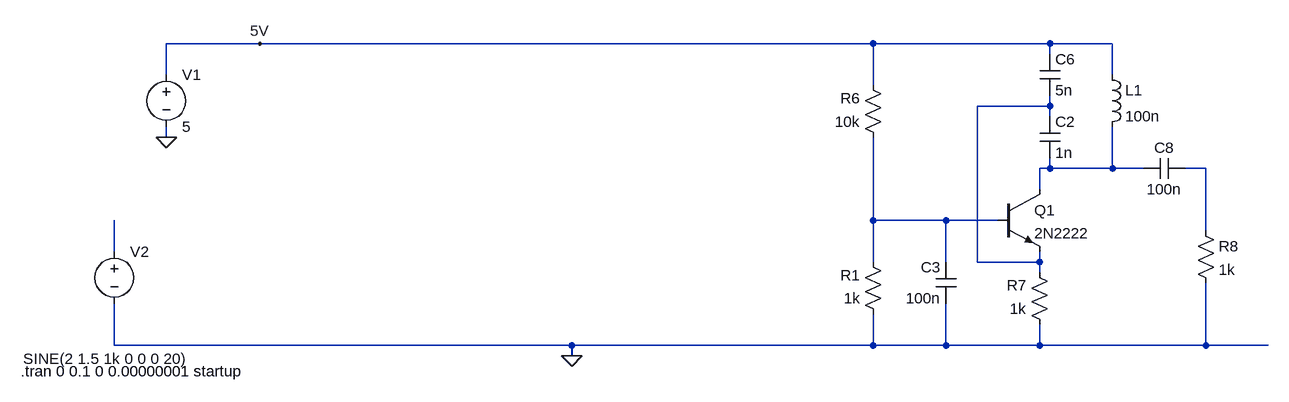
[diagram p0: schematic Colpitts_oscillator.asc]
Colpitts_oscillator.asc, the LTspice schematic file:
Version 4
SHEET 1 1672 680
WIRE -16 -144 -160 -144
WIRE 928 -144 -16 -144
WIRE 1200 -144 928 -144
WIRE 1296 -144 1200 -144
WIRE 1200 -128 1200 -144
WIRE -160 -96 -160 -144
WIRE 1296 -96 1296 -144
WIRE 928 -80 928 -144
WIRE 1200 -48 1200 -64
WIRE 1200 -48 1088 -48
WIRE 1200 -32 1200 -48
WIRE -160 0 -160 -16
WIRE 1200 48 1200 32
WIRE 1200 48 1184 48
WIRE 1296 48 1296 -16
WIRE 1296 48 1200 48
WIRE 1344 48 1296 48
WIRE 1440 48 1408 48
WIRE 1184 80 1184 48
WIRE 928 128 928 0
WIRE 1040 128 928 128
WIRE 1120 128 1040 128
WIRE 1440 144 1440 48
WIRE -240 176 -240 128
WIRE 928 192 928 128
WIRE 1040 192 1040 128
WIRE 1088 192 1088 -48
WIRE 1184 192 1184 176
WIRE 1184 192 1088 192
WIRE 1184 208 1184 192
WIRE -240 320 -240 256
WIRE 464 320 -240 320
WIRE 928 320 928 272
WIRE 928 320 464 320
WIRE 1040 320 1040 256
WIRE 1040 320 928 320
WIRE 1184 320 1184 288
WIRE 1184 320 1040 320
WIRE 1440 320 1440 224
WIRE 1440 320 1184 320
WIRE 1536 320 1440 320
WIRE 464 336 464 320
FLAG 464 336 0
FLAG -16 -144 5V
FLAG -160 0 0
SYMBOL res 944 16 R180
WINDOW 0 36 76 Left 2
WINDOW 3 36 40 Left 2
SYMATTR InstName R6
SYMATTR Value 10k
SYMBOL res 1200 304 R180
WINDOW 0 36 76 Left 2
WINDOW 3 36 40 Left 2
SYMATTR InstName R7
SYMATTR Value 1k
SYMBOL cap 1184 -128 R0
SYMATTR InstName C6
SYMATTR Value 5n
SYMBOL cap 1408 32 R90
WINDOW 0 0 32 VBottom 2
WINDOW 3 32 32 VTop 2
SYMATTR InstName C8
SYMATTR Value 100n
SYMBOL ind 1280 -112 R0
SYMATTR InstName L1
SYMATTR Value 100n
SYMBOL res 1424 128 R0
SYMATTR InstName R8
SYMATTR Value 1k
SYMBOL voltage -160 -112 R0
WINDOW 123 0 0 Left 0
WINDOW 39 0 0 Left 0
SYMATTR InstName V1
SYMATTR Value 5
SYMBOL voltage -240 160 R0
WINDOW 3 -140 181 Left 2
WINDOW 123 0 0 Left 0
WINDOW 39 0 0 Left 0
SYMATTR Value SINE(2 1.5 1k 0 0 0 20)
SYMATTR InstName V2
SYMBOL npn 1120 80 R0
SYMATTR InstName Q1
SYMATTR Value 2N2222
SYMBOL res 944 288 R180
WINDOW 0 36 76 Left 2
WINDOW 3 36 40 Left 2
SYMATTR InstName R1
SYMATTR Value 1k
SYMBOL cap 1184 -32 R0
SYMATTR InstName C2
SYMATTR Value 1n
SYMBOL cap 1056 256 R180
WINDOW 0 24 56 Left 2
WINDOW 3 24 8 Left 2
SYMATTR InstName C3
SYMATTR Value 100n
TEXT -384 360 Left 2 !.tran 0 0.1 0 0.00000001 startup

The netlist it stands for:
* Colpitts_oscillator.asc
R6 N004 5V 10k
R7 0 N001 1k
C6 5V N001 5n
C8 N003 N002 100n
L1 5V N002 100n
R8 N003 0 1k
V1 5V 0 5
V2 N005 0 SINE(2 1.5 1k 0 0 0 20)
Q1 N002 N004 N001 0 2N2222
R1 0 N004 1k
C2 N001 N002 1n
C3 0 N004 100n
.model NPN NPN
.model PNP PNP
.lib standard.bjt
.tran 0 0.1 0 0.00000001 startup
.backanno
.end